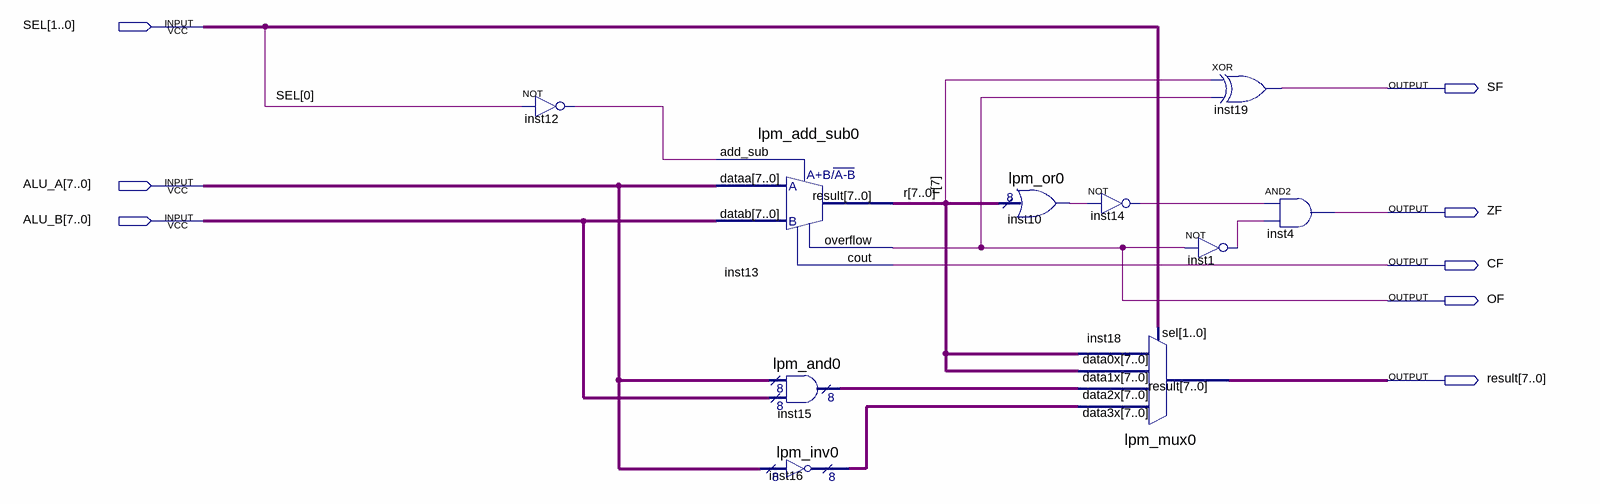
[diagram p0: schematic sheet]
// Quartus schematic COS_lab2.bdf as structural Verilog: 10 symbols, 8 pins
module COS_lab2 (
  input  [1:0] SEL,
  input  [7:0] ALU_A,
  input  [7:0] ALU_B,
  output SF,
  output ZF,
  output CF,
  output OF,
  output [7:0] result
);

  wire inst1_out, inst10_result, inst12_out, inst14_out;
  wire [7:0] inst15_result, inst16_result, r;

  not inst12 (inst12_out, SEL[0]);
  lpm_add_sub0 inst13 (.dataa(ALU_A), .datab(ALU_B), .add_sub(inst12_out), .result(r), .overflow(OF), .cout(CF));
  lpm_and0 inst15 (.data0x(ALU_A), .data1x(ALU_B), .result(inst15_result));
  lpm_inv0 inst16 (.data(ALU_A), .result(inst16_result));
  lpm_or0 inst10 (.data(r), .result(inst10_result));
  not inst14 (inst14_out, inst10_result);
  lpm_mux0 inst18 (.data3x(inst16_result), .data2x(inst15_result), .data1x(r), .data0x(r), .sel(SEL), .result(result));
  xor inst19 (SF, r[7], OF);
  not inst1 (inst1_out, OF);
  and inst4 (ZF, inst14_out, inst1_out);
endmodule
